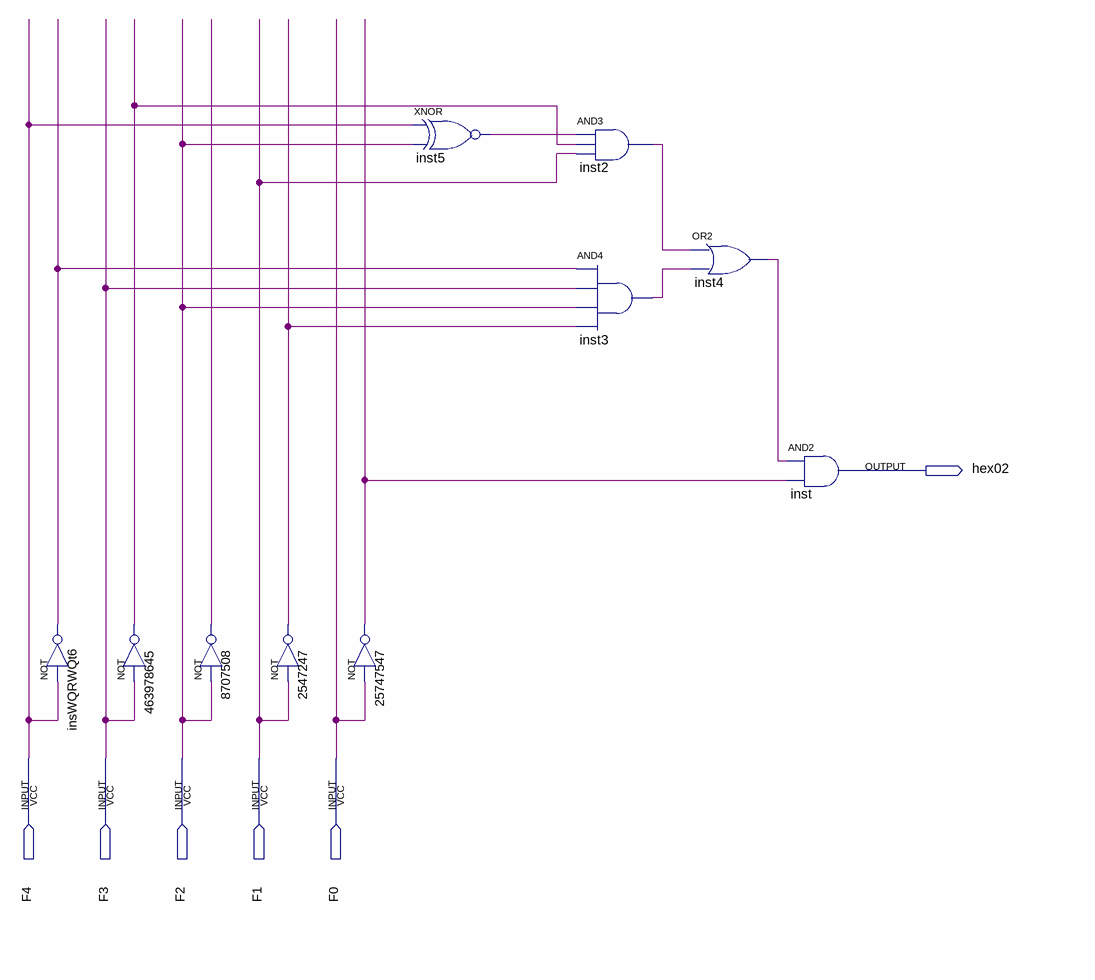
[diagram p0: schematic sheet]
// Quartus schematic HEX0[2].bdf as structural Verilog: 10 symbols, 6 pins
module \HEX0[2]  (
  input  F4,
  input  F3,
  input  F2,
  input  F1,
  input  F0,
  output hex02
);

  wire inst2_out, inst3_out, inst4_out, inst5_out, insWQRWQt6_out, n2547247_out, n8707508_out, n25747547_out,
       n463978645_out;

  not insWQRWQt6 (insWQRWQt6_out, F4);
  not u_463978645 (n463978645_out, F3);
  not u_8707508 (n8707508_out, F2);
  not u_2547247 (n2547247_out, F1);
  xnor inst5 (inst5_out, F4, F2);
  not u_25747547 (n25747547_out, F0);
  and inst2 (inst2_out, inst5_out, n463978645_out, F1);
  and inst3 (inst3_out, insWQRWQt6_out, F3, F2, n2547247_out);
  or inst4 (inst4_out, inst2_out, inst3_out);
  and inst (hex02, inst4_out, n25747547_out);
endmodule
